# EAGLE design FPC_6_Pins_Touch_BreakOut (EAGLE 5.11)
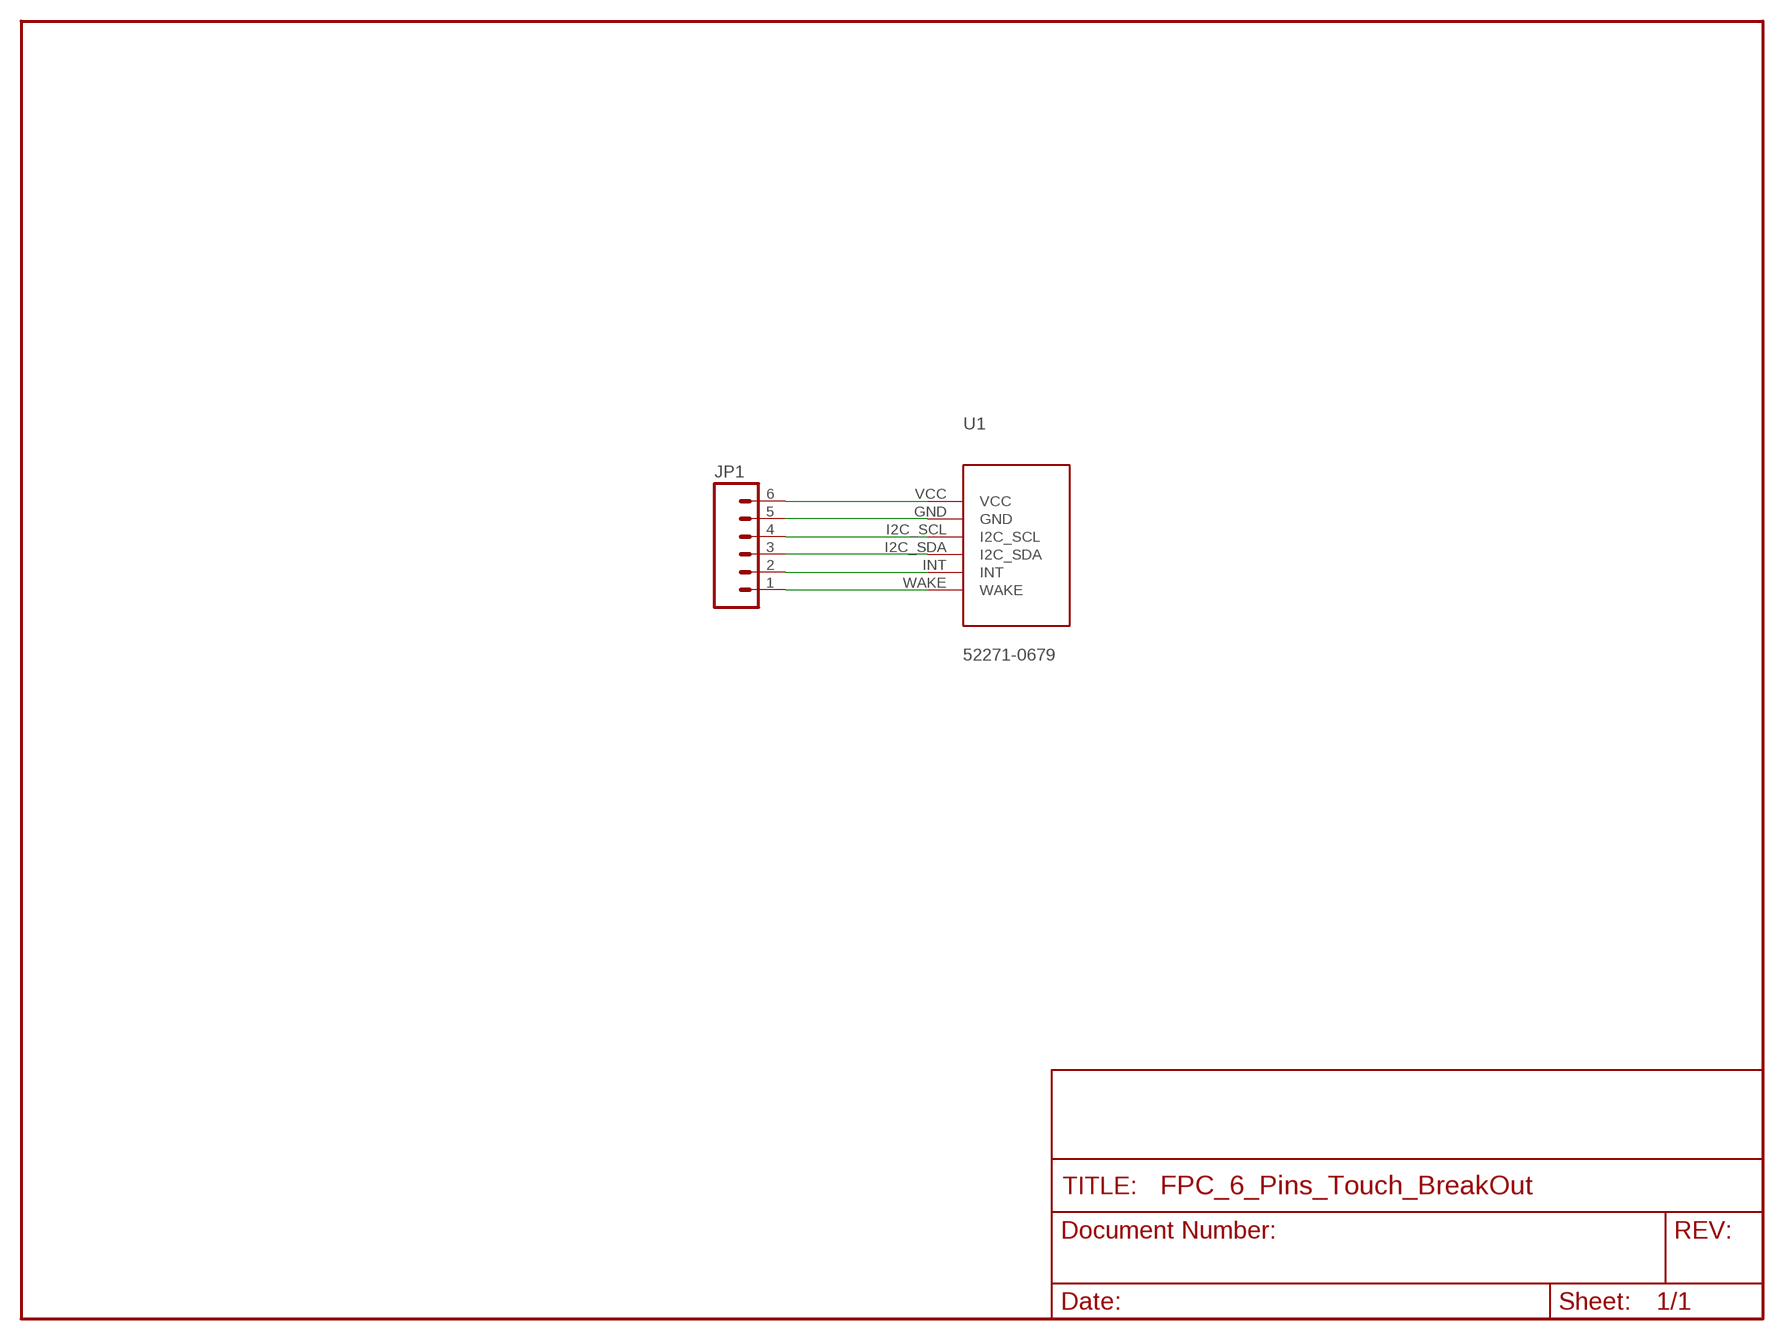
[diagram p0: schematic, sheet 1]

## Parts
JP1  M06SIP  [1X06]
U1  52271-0679  [52271-0679]

## Nets
N$1: JP1.6 U1.VCC
N$2: JP1.5 U1.GND
N$3: JP1.4 U1.I2C_SCL
N$4: JP1.3 U1.I2C_SDA
N$5: JP1.2 U1.INT
N$6: JP1.1 U1.WAKE

## Library data of the parts
JP1 = SparkFun:M06: Header 6 Standard 6-pin 0.1" header. Use with straight break away headers (SKU : PRT-00116), right angle break away headers (PRT-00553), swiss pins (PRT-00743), machine pins (PRT-00117), and female headers (PRT-00115). Molex polarized connector foot print use with SKU : PRT-08094 with associated crimp pins and housings. NOTES ON THE VARIANTS LOCK and LOCK_LONGPADS... This footprint was designed to help hold the alignment of a through-hole component (i.e. 6-pin header) while soldering it into place. You may notice that each hole has been shifted either up or down by 0.005 of an inch from it's more standard position (which is a perfectly straight line). This slight alteration caused the pins (the squares in the middle) to touch the edges of the holes. Because they are alternating, it causes a "brace" to hold the component in place. 0.005 has proven to be the perfect amount of "off-center" position when using our standard breakaway headers. Although looks a little odd when you look at the bare footprint, once you have a header in there, the alteration is very hard to notice. Also, if you push a header all the way into place, it is covered up entirely on the bottom side. This idea of altering the position of holes to aid alignment will be further integrated into the Sparkfun Library for other footprints. It can help hold any component with 3 or more connection pins.
U1 = beaglebone_components:52271-0679: tOUCHSCREEN FPC 6 PINS CONNECTOR

## Board
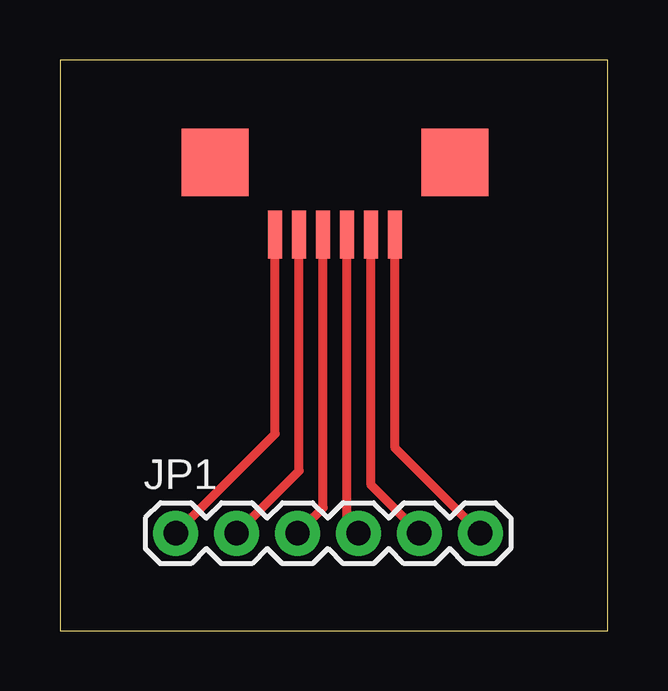
[diagram p1: board, top side]

Size 22.84 x 23.8 mm. Coordinates in mm from the lower left corner, seen from the top.
Outline: 0,0 22.84,0 22.84,23.8 0,23.8 0,0
Copper layers (1*16): Top 0.035mm / dielectric 1.5mm / Bottom 0.035mm
Design rules "default": minimum track width 10mil, minimum drill 24mil, track to track 8mil, track to pad 8mil, pad to pad 8mil, via to via 8mil, smd to smd 8mil, copper to edge 40mil, drill to drill 8mil, minimum pad ring 10mil, minimum via ring 8mil, stop-mask expansion 4mil, vias tented up to drill 0mil, thermal gap 10mil

### Footprints (pad centres in the part's own frame; a part is rotated, then mirrored left to right if it is on the bottom)
1X06 = drill 1.016 pad 1.88 round: 1 0,0; 2 2.54,0; 3 5.08,0; 4 7.62,0; 5 10.16,0; 6 12.7,0
52271-0679 = smd 0.6 x 2: GND 1,1; I2C_SCL 2,1; I2C_SDA 3,1; INT 4,1; VCC 0,1; WAKE 5,1 | smd 2.8 x 2.8: P$7 -2.5,-2; P$8 7.5,-2

### Placement (x,y rotation side)
JP1  4.83,4.06 0 top
U1  13.97,17.53 180 top

### Tracks (layer width: path | path; a pad name or v marks a point on that pad's centre or on a via)
N$1
  Top 0.381: JP1.6 13.97,7.62 U1.VCC
N$2
  Top 0.381: JP1.5 12.97,6.08 U1.GND
N$3
  Top 0.381: JP1.4 11.97,4.54 U1.I2C_SCL
N$4
  Top 0.381: JP1.3 10.97,5.13 U1.I2C_SDA
N$5
  Top 0.381: JP1.2 9.97,6.67 U1.INT
N$6
  Top 0.381: JP1.1 8.97,8.21 U1.WAKE